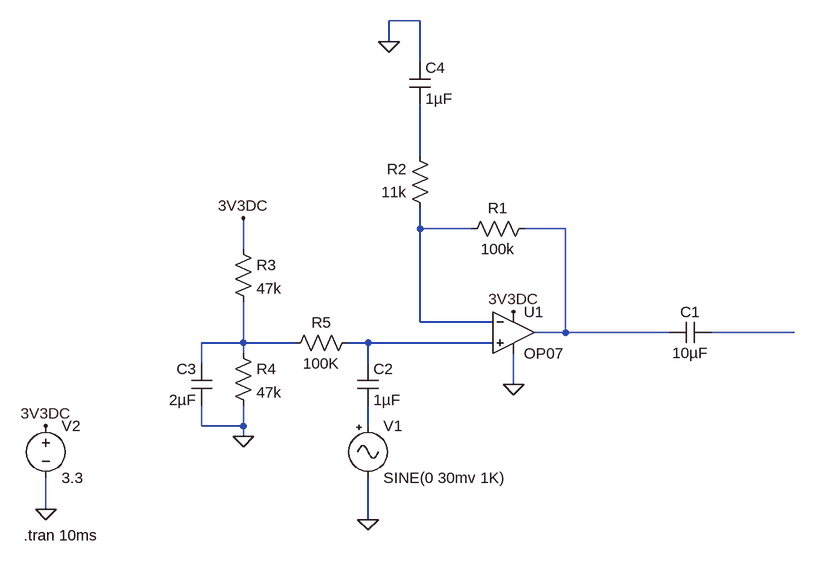
[diagram p0: schematic Audio_Amp.asc]
Audio_Amp.asc, the LTspice schematic file:
Version 4
SHEET 1 880 680
WIRE -16 -608 -64 -608
WIRE -64 -576 -64 -608
WIRE -16 -544 -16 -608
WIRE -16 -400 -16 -480
WIRE -16 -288 -16 -320
WIRE 64 -288 -16 -288
WIRE 208 -288 144 -288
WIRE -288 -256 -288 -304
WIRE -16 -144 -16 -288
WIRE 96 -144 -16 -144
WIRE 208 -128 208 -288
WIRE 208 -128 160 -128
WIRE 368 -128 208 -128
WIRE 560 -128 432 -128
WIRE -288 -112 -288 -176
WIRE -288 -112 -352 -112
WIRE -208 -112 -288 -112
WIRE -96 -112 -128 -112
WIRE 96 -112 -96 -112
WIRE -288 -96 -288 -112
WIRE -352 -80 -352 -112
WIRE -96 -80 -96 -112
WIRE 128 -48 128 -96
WIRE -352 16 -352 -16
WIRE -288 16 -288 -16
WIRE -288 16 -352 16
WIRE -96 16 -96 -16
WIRE -288 32 -288 16
WIRE -592 144 -592 96
WIRE -96 160 -96 96
FLAG -592 144 0
FLAG -592 16 3V3DC
FLAG -288 -304 3V3DC
FLAG -288 32 0
FLAG -96 160 0
FLAG -64 -576 0
FLAG 128 -48 0
FLAG 128 -160 3V3DC
SYMBOL Misc\\signal -96 0 R0
WINDOW 123 0 0 Left 0
WINDOW 39 0 0 Left 0
SYMATTR InstName V1
SYMATTR Value SINE(0 30mv 1K)
SYMBOL res 160 -304 R90
WINDOW 0 0 56 VBottom 2
WINDOW 3 32 56 VTop 2
SYMATTR InstName R1
SYMATTR Value 100k
SYMBOL Opamps\\OP07 128 -192 R0
SYMATTR InstName U1
SYMBOL voltage -592 0 R0
WINDOW 123 0 0 Left 0
WINDOW 39 0 0 Left 0
SYMATTR InstName V2
SYMATTR Value 3.3
SYMBOL cap 432 -144 R90
WINDOW 0 0 32 VBottom 2
WINDOW 3 32 32 VTop 2
SYMATTR InstName C1
SYMATTR Value 10µF
SYMATTR SpiceLine V=25 Irms=100
SYMBOL res -304 -272 R0
SYMATTR InstName R3
SYMATTR Value 47k
SYMBOL res -304 -112 R0
SYMATTR InstName R4
SYMATTR Value 47k
SYMBOL res -112 -128 R90
WINDOW 0 0 56 VBottom 2
WINDOW 3 32 56 VTop 2
SYMATTR InstName R5
SYMATTR Value 100K
SYMBOL cap -336 -16 R180
WINDOW 0 24 56 Left 2
WINDOW 3 24 8 Left 2
SYMATTR InstName C3
SYMATTR Value 2µF
SYMBOL res 0 -304 R180
WINDOW 0 36 76 Left 2
WINDOW 3 36 40 Left 2
SYMATTR InstName R2
SYMATTR Value 11k
SYMBOL cap -112 -80 R0
SYMATTR InstName C2
SYMATTR Value 1µF
SYMBOL cap -32 -544 R0
SYMATTR InstName C4
SYMATTR Value 1µF
TEXT -626 184 Left 2 !.tran 10ms

The netlist it stands for:
* Audio_Amp.asc
V1 N007 0 SINE(0 30mv 1K)
R1 N003 N002 100k
XU1 N006 N002 3V3DC 0 N003 LT1001  ; OP07, pins In+ In- V+ V- OUT
V2 3V3DC 0 3.3
C1 N004 N003 10µF V=25 Irms=100
R3 3V3DC N005 47k
R4 N005 0 47k
R5 N006 N005 100K
C3 0 N005 2µF
R2 N002 N001 11k
C2 N006 N007 1µF
C4 0 N001 1µF
.tran 10ms
.lib LTC.lib
.backanno
.end